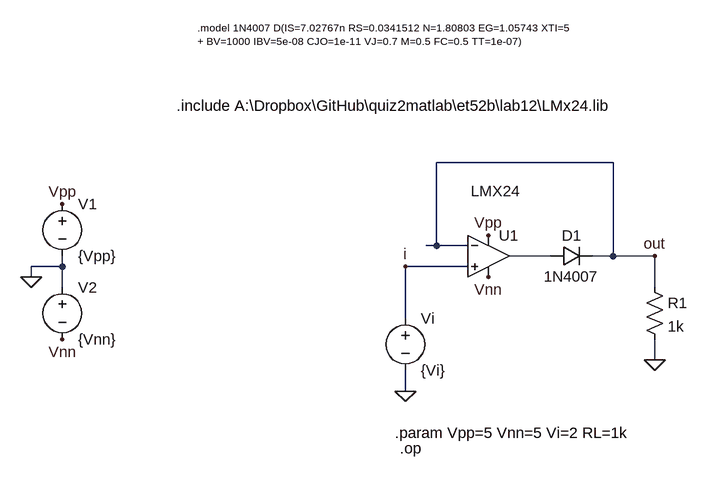
[diagram p0: schematic lab12e.asc]
lab12e.asc, the LTspice schematic file:
Version 4
SHEET 1 988 680
WIRE 208 32 -64 32
WIRE -64 160 -64 32
WIRE -64 160 -80 160
WIRE -16 160 -64 160
WIRE 112 176 48 176
WIRE 208 176 208 32
WIRE 208 176 176 176
WIRE 272 176 208 176
WIRE -640 192 -640 176
WIRE -640 192 -688 192
WIRE -16 192 -112 192
WIRE -688 208 -688 192
WIRE -640 224 -640 192
WIRE 272 224 272 176
WIRE -112 272 -112 192
WIRE 272 336 272 304
WIRE -112 384 -112 352
FLAG 16 144 Vpp
FLAG 16 208 Vnn
FLAG -688 208 0
FLAG -640 96 Vpp
FLAG -640 304 Vnn
FLAG -112 384 0
FLAG 272 176 out
FLAG 272 336 0
FLAG -112 192 i
SYMBOL Opamps\\opamp2 16 112 R0
WINDOW 3 -27 -36 Left 2
SYMATTR InstName U1
SYMATTR Value LMX24
SYMBOL voltage -640 80 R0
SYMATTR InstName V1
SYMATTR Value {Vpp}
SYMBOL voltage -640 208 R0
SYMATTR InstName V2
SYMATTR Value {Vnn}
SYMBOL voltage -112 256 R0
SYMATTR InstName Vi
SYMATTR Value {Vi}
SYMBOL res 256 208 R0
SYMATTR InstName R1
SYMATTR Value 1k
SYMBOL diode 112 192 R270
WINDOW 0 32 32 VTop 2
WINDOW 3 0 32 VBottom 2
SYMATTR InstName D1
SYMATTR Value 1N4007
TEXT -464 -56 Left 2 !.include A:\\Dropbox\\GitHub\\quiz2matlab\\et52b\\lab12\\LMx24.lib
TEXT -128 448 Left 2 !.param Vpp=5 Vnn=5 Vi=2 RL=1k
TEXT -120 472 Left 2 !.op
TEXT -432 -176 Left 1 !.model 1N4007 D(IS=7.02767n RS=0.0341512 N=1.80803 EG=1.05743 XTI=5 \n+ BV=1000 IBV=5e-08 CJO=1e-11 VJ=0.7 M=0.5 FC=0.5 TT=1e-07)

The netlist it stands for:
* lab12e.asc
XU1 i out Vpp Vnn N001 LMX24  ; pins In+ In- V+ V- OUT
V1 Vpp 0 {Vpp}
V2 0 Vnn {Vnn}
Vi i 0 {Vi}
R1 out 0 1k
D1 N001 out 1N4007
.model D D
.lib standard.dio
.include A:\Dropbox\GitHub\quiz2matlab\et52b\lab12\LMx24.lib
.param Vpp=5 Vnn=5 Vi=2 RL=1k
.op
.model 1N4007 D(IS=7.02767n RS=0.0341512 N=1.80803 EG=1.05743 XTI=5
+ BV=1000 IBV=5e-08 CJO=1e-11 VJ=0.7 M=0.5 FC=0.5 TT=1e-07)
.backanno
.end